# EAGLE schematic tlacitka (EAGLE 9.5.1)
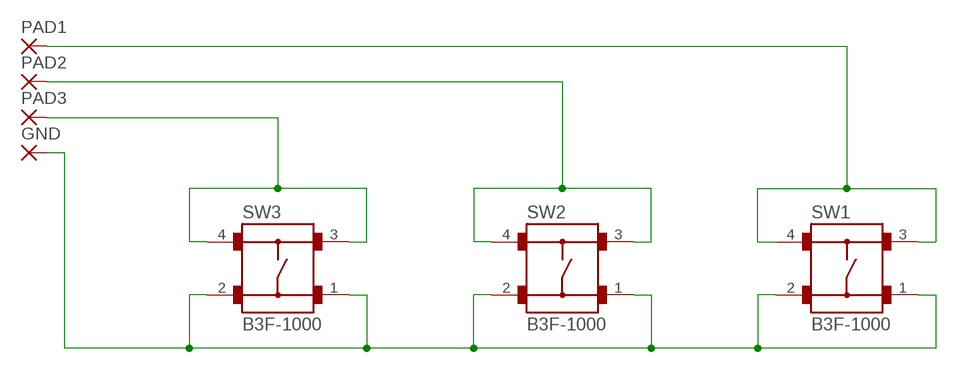
[diagram p0: schematic, sheet 1]

## Parts
GND  SMD5  [SMD2,54-5,08]
PAD1  SMD5  [SMD2,54-5,08]
PAD2  SMD5  [SMD2,54-5,08]
PAD3  SMD5  [SMD2,54-5,08]
SW1  B3F-1000  [B3F-1000]
SW2  B3F-1000  [B3F-1000]
SW3  B3F-1000  [B3F-1000]

## Nets
N$1: PAD1.1(P) SW1.3 SW1.4
N$2: PAD2.1(P) SW2.3 SW2.4
N$3: GND.1(P) SW1.1 SW1.2 SW2.1 SW2.2 SW3.1 SW3.2
N$4: PAD3.1(P) SW3.3 SW3.4

## Library data of the parts
GND PAD1-PAD3 = wirepad:SMD5: SMD PAD
SW1-SW3 = Switch:B3F-1000: Tactile Switch SPST-NO Top Actuated Through Hole Manufacturer's datasheet <https://omronfs.omron.com/en_US/ecb/products/pdf/en-b3f.pdf>; CREATED_BY: PCBLayout.com; DIGI_KEY_PART_NUMBER: SW400-ND; MANUFACTURER: Omron Electronics Inc-EMC Div; MPN: B3F-1000; PACKAGE: SPST-NO